# EAGLE design main_board (EAGLE 7.5.0)
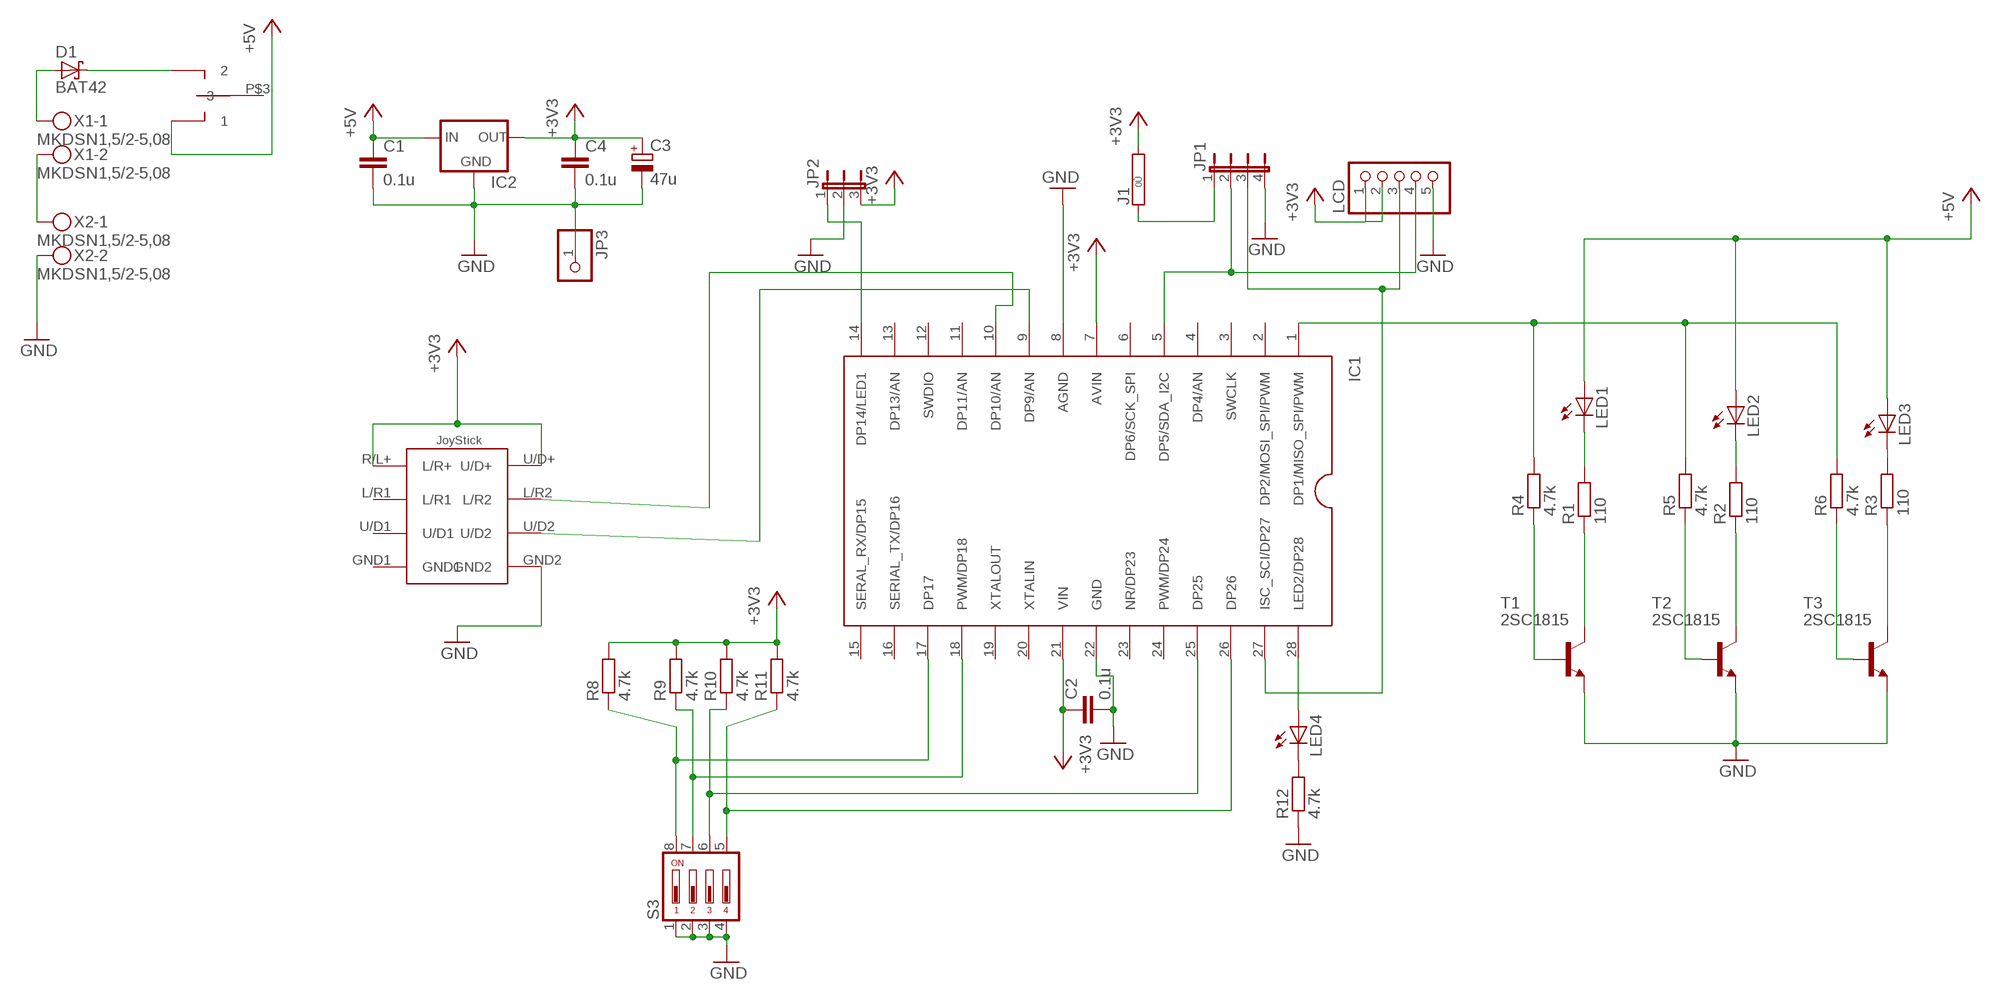
[diagram p0: schematic, sheet 1]

## Parts
C1  0.1u  C-EU025-024X044  [C025-024X044]
C2  0.1u  C-EU025-024X044  [C025-024X044]
C3  47u  CPOL-EUE2.5-5  [E2,5-5]
C4  0.1u  C-EU025-024X044  [C025-024X044]
D1  BAT42  [DO35-10]
IC1  LPC1114FN28  [DIP28]
IC2  78XXL  [78XXL]
J1  0R  [0R/10]
JP1  JP4E  [JP4]
JP2  JP2E  [JP2]
JP3  PINHD-1X1  [1X01]
LCD  PINHD-1X5  [1X05]
LED1  LED5MM  [LED5MM]
LED2  LED5MM  [LED5MM]
LED3  LED5MM  [LED5MM]
LED4  LED3MM  [LED3MM]
R1  110  R-EU_0207/10  [0207/10]
R2  110  R-EU_0207/10  [0207/10]
R3  110  R-EU_0207/10  [0207/10]
R4  4.7k  R-EU_0204/7  [0204/7]
R5  4.7k  R-EU_0204/7  [0204/7]
R6  4.7k  R-EU_0204/7  [0204/7]
R8  4.7k  R-EU_0204/7  [0204/7]
R9  4.7k  R-EU_0204/7  [0204/7]
R10  4.7k  R-EU_0204/7  [0204/7]
R11  4.7k  R-EU_0204/7  [0204/7]
R12  4.7k  R-EU_0204/7  [0204/7]
S3  DIP04YL  [DIP04YL]
T1  2SC1815  [TO92-ECB]
T2  2SC1815  [TO92-ECB]
T3  2SC1815  [TO92-ECB]
U$1  ANALOGJOYSTICK  [ANLOGJOYSTICK]
U$2  TOGGLE-B-12JV  [TOGGLE-B-12JV]
X1  MKDSN1,5/2-5,08  [MKDSN1,5/2-5,08]
X2  MKDSN1,5/2-5,08  [MKDSN1,5/2-5,08]

## Nets
+3V3: C2.1 C3.+ C4.1 IC1.7(AVIN) IC1.21(VIN) IC2.OUT J1.2 JP2.3 LCD.1 LCD.2 R8.2 R9.2 R10.2 R11.2 U$1.R/L+(L/R+) U$1.U/D+
+5V: C1.1 IC2.IN LED1.A LED2.A LED3.A U$2.P$1
GND: C1.2 C2.2 C3.- C4.2 IC1.8(AGND) IC1.22(GND) IC2.GND JP1.4 JP2.2 JP3.1 LCD.5 R12.1 S3.1 S3.2 S3.3 S3.4 T1.E T2.E T3.E U$1.GND2 X2.2
N$1: R4.1 T1.B
N$2: IC1.1(DP1/MISO_SPI/PWM) R4.2 R5.2 R6.2
N$3: R5.1 T2.B
N$4: R6.1 T3.B
N$5: IC1.27(ISC_SCI/DP27) JP1.3 LCD.3
N$6: LED2.K(C) R2.2
N$7: LED1.K(C) R1.2
N$8: LED3.K(C) R3.2
N$9: R1.1 T1.C
N$10: R2.1 T2.C
N$11: R3.1 T3.C
N$12: IC1.5(DP5/SDA_I2C) JP1.2 LCD.4
N$13: IC1.14(DP14/LED1) JP2.1
N$14: LED4.K(C) R12.2
N$15: IC1.28(LED2/DP28) LED4.A
N$16: IC1.17(DP17) R8.1 S3.8
N$17: IC1.18(PWM/DP18) R9.1 S3.7
N$18: IC1.25(DP25) R10.1 S3.6
N$19: IC1.26(DP26) R11.1 S3.5
N$20: IC1.10(DP10/AN) U$1.L/R2
N$21: IC1.9(DP9/AN) U$1.U/D2
N$22: X1.2 X2.1
N$23: D1.A X1.1
N$24: D1.C U$2.P$2
N$25: J1.1 JP1.1
Unconnected: IC1.2(DP2/MOSI_SPI/PWM) IC1.3(SWCLK) IC1.4(DP4/AN) IC1.6(DP6/SCK_SPI) IC1.11(DP11/AN) IC1.12(SWDIO) IC1.13(DP13/AN) IC1.15(SERAL_RX/DP15) IC1.16(SERIAL_TX/DP16) IC1.19(XTALOUT) IC1.20(XTALIN) IC1.23(NR/DP23) IC1.24(PWM/DP24) U$1.GND1 U$1.L/R1 U$1.U/D1 U$2.P$3

## Library data of the parts
C1 C2 C4 = rcl:C-EU: CAPACITOR, European symbol
C3 = rcl:CPOL-EU: POLARIZED CAPACITOR, European symbol
D1 = diode:BAT42: DIODE barrier diode
IC1 = lpc1114fn28:LPC1114FN28
IC2 = v-reg:78XXL: VOLTAGE REGULATOR
J1 = jumper:0R: Bridge 0R 10mm
JP1 = jumper:JP4E: JUMPER
JP2 = jumper:JP2E: JUMPER
JP3 = pinhead:PINHD-1X1: PIN HEADER
LCD = pinhead:PINHD-1X5: PIN HEADER
LED1-LED4 = led:LED: LED OSRAM: - CHIPLED LG R971, LG N971, LY N971, LG Q971, LY Q971, LO R971, LY R971 LH N974, LH R974 LS Q976, LO Q976, LY Q976 LO Q996 - Hyper CHIPLED LW Q18S LB Q993, LB Q99A, LB R99A - SideLED LS A670, LO A670, LY A670, LG A670, LP A670 LB A673, LV A673, LT A673, LW A673 LH A674 LY A675 LS A676, LA A676, LO A676, LY A676, LW A676 LS A679, LY A679, LG A679 - Hyper Micro SIDELED® LS Y876, LA Y876, LO Y876, LY Y876 LT Y87S - SmartLED LW L88C, LW L88S LB L89C, LB L89S, LG L890 LS L89K, LO L89K, LY L89K LS L896, LA L896, LO L896, LY L896 - TOPLED LS T670, LO T670, LY T670, LG T670, LP T670 LSG T670, LSP T670, LSY T670, LOP T670, LYG T670 LG T671, LOG T671, LSG T671 LB T673, LV T673, LT T673, LW T673 LH T674 LS T676, LA T676, LO T676, LY T676, LB T676, LH T676, LSB T676, LW T676 LB T67C, LV T67C, LT T67C, LS T67K, LO T67K, LY T67K, LW E67C LS E67B, LA E67B, LO E67B, LY E67B, LB E67C, LV E67C, LT E67C LW T67C LS T679, LY T679, LG T679 LS T770, LO T770, LY T770, LG T770, LP T770 LB T773, LV T773, LT T773, LW T773 LH T774 LS E675, LA E675, LY E675, LS T675 LS T776, LA T776, LO T776, LY T776, LB T776 LHGB T686 LT T68C, LB T68C - Hyper Mini TOPLED® LB M676 - Mini TOPLED Santana® LG M470 LS M47K, LO M47K, LY M47K Source: http://www.osram.convergy.de LUXEON: - LUMILED® LXK2-PW12-R00, LXK2-PW12-S00, LXK2-PW14-U00, LXK2-PW14-V00 LXK2-PM12-R00, LXK2-PM12-S00, LXK2-PM14-U00 LXK2-PE12-Q00, LXK2-PE12-R00, LXK2-PE12-S00, LXK2-PE14-T00, LXK2-PE14-U00 LXK2-PB12-K00, LXK2-PB12-L00, LXK2-PB12-M00, LXK2-PB14-N00, LXK2-PB14-P00, LXK2-PB14-Q00 LXK2-PR12-L00, LXK2-PR12-M00, LXK2-PR14-Q00, LXK2-PR14-R00 LXK2-PD12-Q00, LXK2-PD12-R00, LXK2-PD12-S00 LXK2-PH12-R00, LXK2-PH12-S00 LXK2-PL12-P00, LXK2-PL12-Q00, LXK2-PL12-R00 Source: www.luxeon.com KINGBRIGHT: KA-3528ASYC Source: www.kingbright.com
R1-R6 R8-R12 = rcl:R-EU_: RESISTOR, European symbol
S3 = switch-dil:DIP04YL: DIL/CODE SWITCH; OC_FARNELL: unknown; OC_NEWARK: unknown
T1-T3 = transistor:2SC1815: NPN EPITAXIAL TRANSISTOR Source: TOSHIBA .. 2SC1815 1.pdf
U$1 = AnalogJoyStick:ANALOGJOYSTICK
U$2 = toggle_b-12JV:TOGGLE-B-12JV
X1 X2 = con-phoenix-508:MKDSN1,5/2-5,08: MKDSN 1,5/ 2-5,08 Printklemme Nennstrom: 13,5 A Nennspannung: 250 V Rastermaß: 5,08 mm Polzahl: 2 Anschlussart: Schraubanschluss Montage: Löten Anschlussrichtung Leiter/Platine: 0 ° Artikelnummer: 1729128 Source: http://eshop.phoenixcontact.com .. 1729128.pdf

## Board
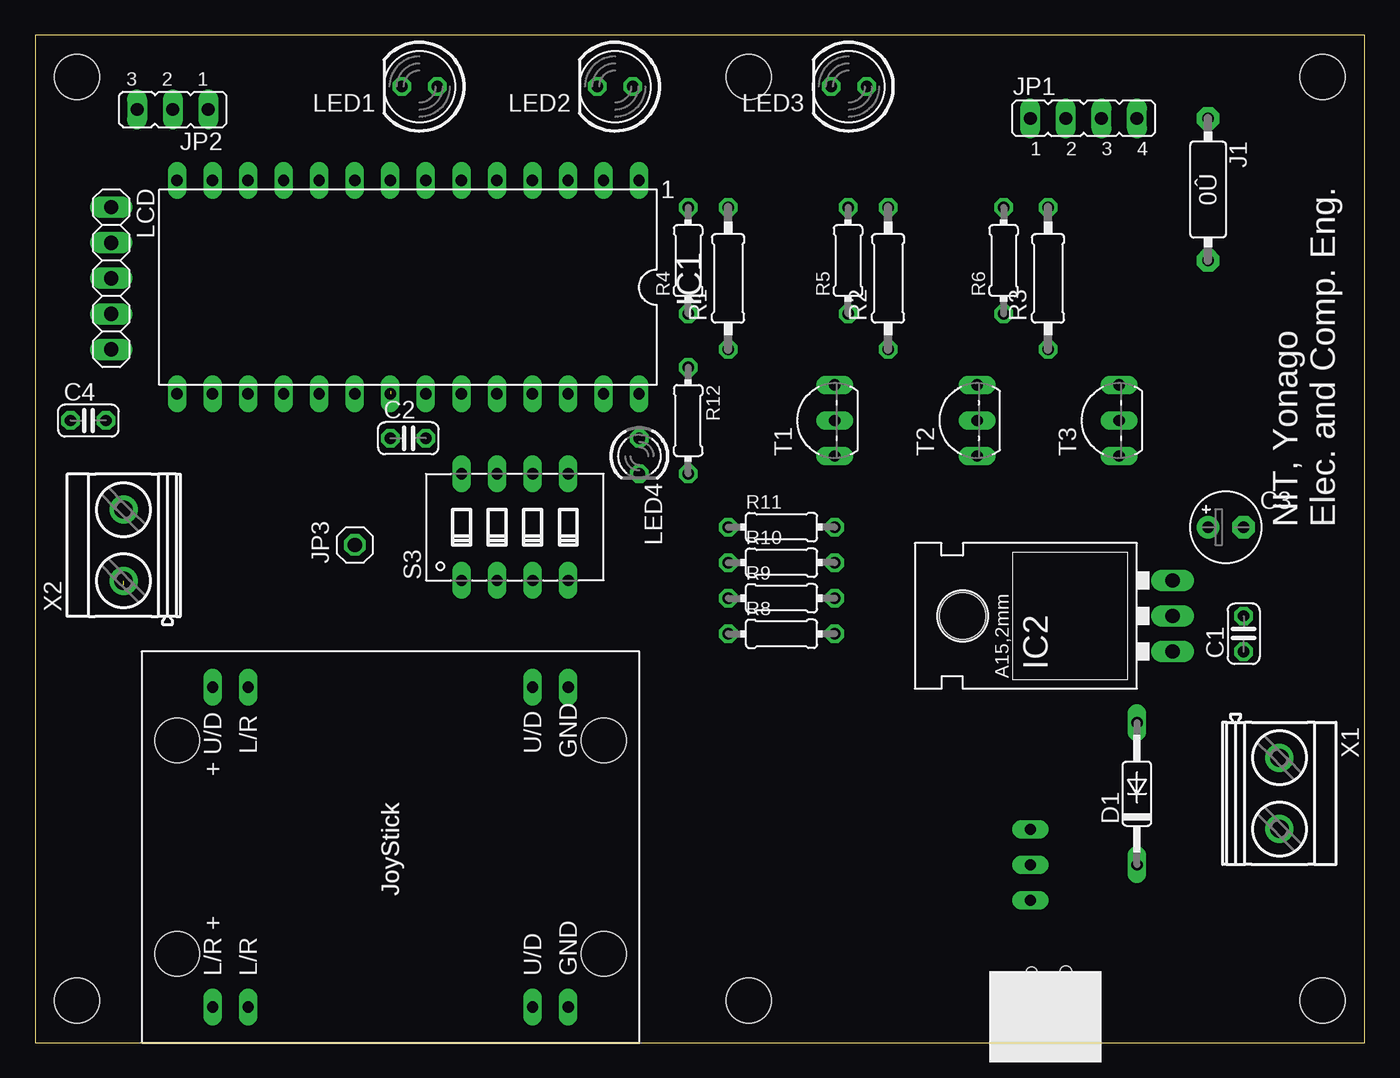
[diagram p1: board, top side]
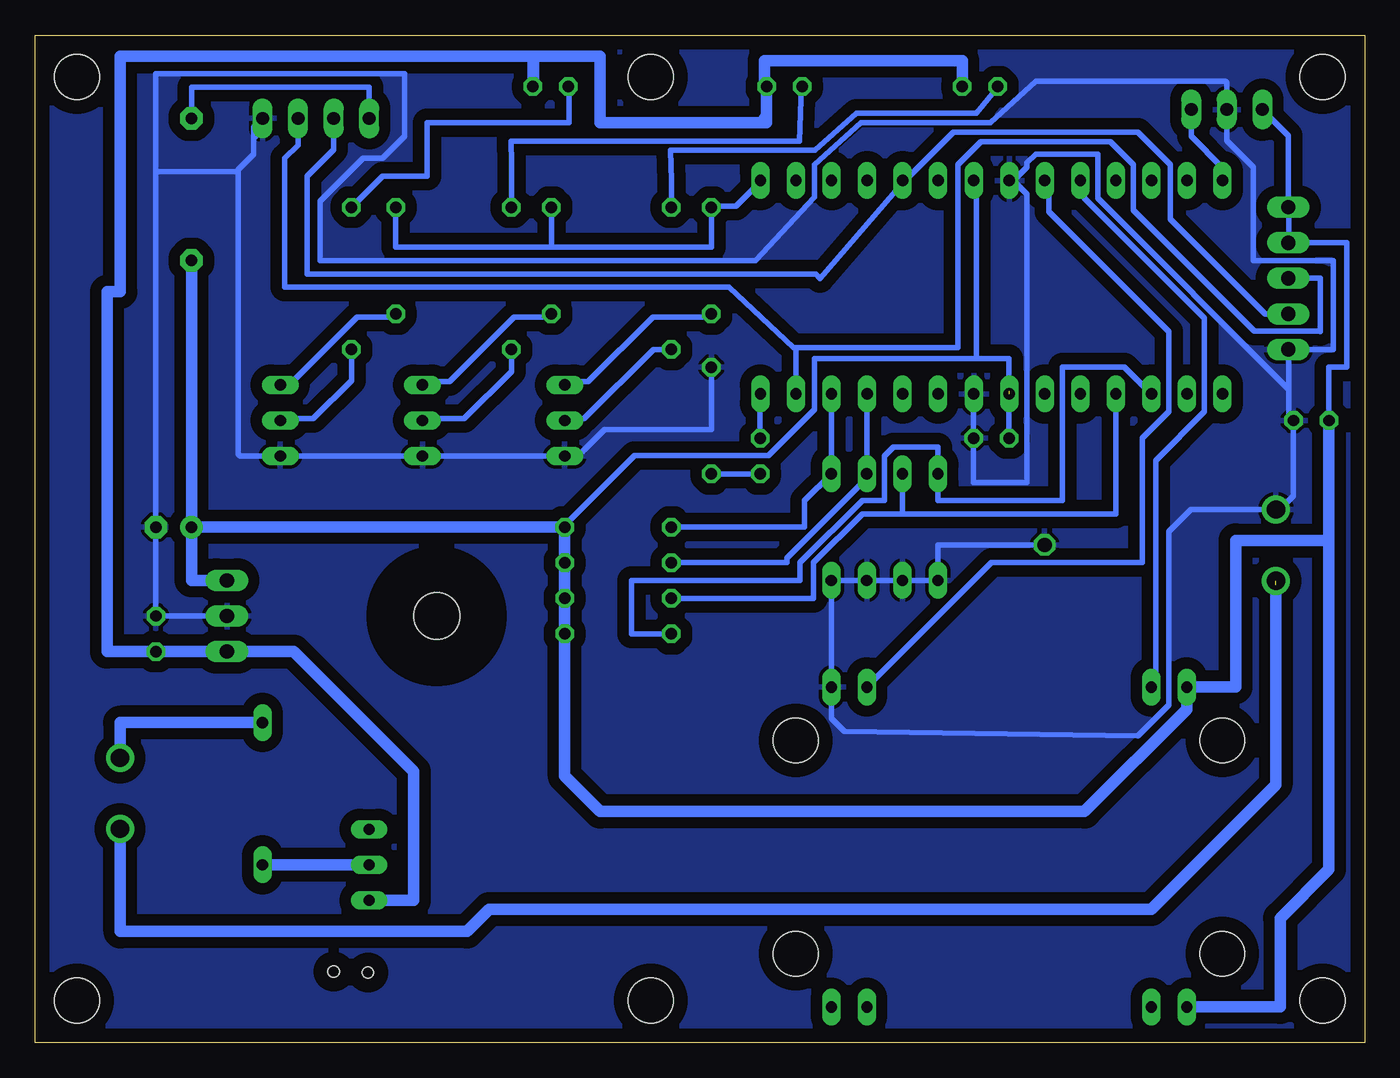
[diagram p2: board, bottom side, seen from below]

Size 95 x 72 mm. Coordinates in mm from the lower left corner, seen from the top.
Outline: 0,0 95,0 95,72 0,72 0,0
Copper layers (1*16): Top 0.035mm / dielectric 1.5mm / Bottom 0.035mm
Design rules "default *": minimum track width 16mil, minimum drill 24mil, track to track 10mil, track to pad 10mil, pad to pad 10mil, via to via 10mil, smd to smd 8mil, copper to edge 40mil, drill to drill 8mil, minimum pad ring 10mil, minimum via ring 8mil, stop-mask expansion 4mil, vias tented up to drill 0mil, thermal gap 10mil
Holes 3.2 mm at 3,3 3,69 92,69 92,3 51,3 51,69

### Footprints (pad centres in the part's own frame; a part is rotated, then mirrored left to right if it is on the bottom)
C025-024X044 = drill 0.813 octagon: 1 -1.27,0; 2 1.27,0
E2,5-5 = drill 0.813 pad 1.6: + -1.27,0 | drill 0.813 pad 1.6 octagon: - 1.27,0
DO35-10 = drill 0.813 long: A 5.08,0; C -5.08,0
DIP28 = drill 0.813 long: 1 -16.51,-7.62; 2 -13.97,-7.62; 3 -11.43,-7.62; 4 -8.89,-7.62; 5 -6.35,-7.62; 6 -3.81,-7.62; 7 -1.27,-7.62; 8 1.27,-7.62; 9 3.81,-7.62; 10 6.35,-7.62; 11 8.89,-7.62; 12 11.43,-7.62; 13 13.97,-7.62; 14 16.51,-7.62; 15 16.51,7.62; 16 13.97,7.62; 17 11.43,7.62; 18 8.89,7.62; 19 6.35,7.62; 20 3.81,7.62; 21 1.27,7.62; 22 -1.27,7.62; 23 -3.81,7.62; 24 -6.35,7.62; 25 -8.89,7.62; 26 -11.43,7.62; 27 -13.97,7.62; 28 -16.51,7.62
78XXL = drill 1.016 long: GND 0,-3.81; IN -2.54,-3.81; OUT 2.54,-3.81 | hole 3.302: 0,11.176
0R/10 = drill 0.813 pad 1.6 octagon: 1 -5.08,0; 2 5.08,0
JP4 = drill 0.914 long: 1 -3.81,0; 2 -1.27,0; 3 1.27,0; 4 3.81,0
JP2 = drill 0.914 long: 1 -2.54,0; 2 0,0; 3 2.54,0
1X01 = drill 1.016 octagon: 1 0,0
1X05 = drill 1.016 long: 1 -5.08,0; 2 -2.54,0; 3 0,0; 4 2.54,0; 5 5.08,0
LED5MM = drill 0.813 octagon: A -1.27,0; K 1.27,0
LED3MM = drill 0.813 octagon: A -1.27,0; K 1.27,0
0207/10 = drill 0.813 octagon: 1 -5.08,0; 2 5.08,0
0204/7 = drill 0.813 octagon: 1 -3.81,0; 2 3.81,0
DIP04YL = drill 0.813 long: 1 -3.81,-3.81; 2 -1.27,-3.81; 3 1.27,-3.81; 4 3.81,-3.81; 5 3.81,3.81; 6 1.27,3.81; 7 -1.27,3.81; 8 -3.81,3.81
TO92-ECB = drill 0.813 long: B 2.54,0; C 0,0; E -2.54,0
ANLOGJOYSTICK = drill 0.8 long: GND1 2.54,5.08; GND2 25.4,5.08; L/R1 2.54,27.94; L/R2 25.4,27.94; R/L+ 2.54,30.48; U/D1 2.54,7.62; U/D2 25.4,7.62; U/D+ 25.4,30.48 | hole 3.2: 6.35,2.54; 21.59,2.54; 6.35,33.02; 21.59,33.02
TOGGLE-B-12JV = drill 0.8 long: P$1 5.08,5.08; P$2 7.62,5.08; P$3 10.16,5.08 | hole 0.8: 0,2.54; -0.08,5
MKDSN1,5/2-5,08 = drill 1.3 pad 2: 1 -2.561,0.025; 2 2.519,0.025

### Placement (x,y rotation side)
C1  86.36,29.21 90 top
C2  26.67,43.18 0 top
C3  85.09,36.83 0 top
C4  3.81,44.45 0 top
D1  78.74,17.78 90 top
IC1  26.66,53.98 180 top
IC2  77.47,30.48 90 top
J1  83.82,60.96 270 top
JP1  74.93,66.04 0 top
JP2  9.84,66.67 180 top
JP3  22.86,35.56 90 top
LCD  5.45,54.61 270 top
LED1  27.48,68.31 180 top
LED2  41.45,68.31 180 top
LED3  58.15,68.31 180 top
LED4  43.18,41.91 270 top
R1  49.53,54.61 90 top
R2  60.96,54.61 90 top
R3  72.39,54.61 90 top
R4  46.67,55.88 90 top
R5  58.1,55.88 90 top
R6  69.22,55.88 90 top
R8  53.34,29.21 0 top
R9  53.34,31.75 0 top
R10  53.34,34.29 0 top
R11  53.34,36.83 0 top
R12  46.67,44.45 270 top
S3  34.29,36.83 0 top
T1  57.15,44.45 90 top
T2  67.31,44.45 90 top
T3  77.47,44.45 90 top
U$1  43.18,0 90 top
U$2  76.2,5.08 90 top
X1  88.9,17.78 270 top
X2  6.35,35.56 90 top

### Tracks (layer width: path | path; a pad name or v marks a point on that pad's centre or on a via)
+3V3  (1 unrouted)
  Bottom 0.406: 5.4,59.69 LCD.1 | 57.15,34.92 R10.2 | C2.1 25.43,43.26 25.43,46.35 IC1.21 | 27.74,48.87 27.74,61.42 IC1.7 | 27.74,48.87 39.29,48.87 39.29,45.24 42.6,41.94 52.17,41.94 57.12,36.98 R11.2 | C4.1 2.54,48.26 1.27,48.26 1.27,57.15 5.4,57.15 | 5.4,57.15 LCD.2 | 5.4,57.15 5.4,59.64 LCD.1 | LCD.1 5.45,64.82 JP2.3 | 25.43,46.56 25.43,48.87 27.74,48.87
  Bottom 0.813: IC2.OUT 83.82,33.02 C3.+ | C3.+ J1.2 | C3.+ R11.2 R10.2 R9.2 R8.2 57.15,19.05 54.61,16.51 20,16.51 12.7,23.81 U$1.U/D+ 9.21,25.4 9.21,35.88 2.54,35.88 | 2.54,35.88 2.54,12.38 6.03,8.89 6.03,2.54 U$1.R/L+ | C4.1 2.54,35.88
+5V
  Bottom 0.813: U$2.P$1 67.94,10.16 67.94,19.37 76.52,27.94 IC2.IN C1.1 89.85,27.94 89.85,53.66 88.9,53.66 88.9,70.48 59.42,70.48 LED3.A 59.37,68.31 59.37,70.48 54.61,70.48 54.61,65.72 42.72,65.72 42.72,66.18 | 42.86,66.04 42.72,66.18 | 42.72,66.18 LED2.A 42.86,68.31 42.86,70.17 28.75,70.17 LED1.A
GND
  Bottom 0.406: JP3.1 30.48,35.56 S3.1 S3.2 S3.3 S3.4 U$1.GND2 38.1,23.16 37.16,22.22 16.19,21.91 13.97,24.13 13.97,36.51 12.4,38.08 X2.2 6.05,38.08 5.08,39.05 C4.2 5.4,44.77 5.4,46.67 | IC1.22 C2.2 27.94,40.01 24.13,40.01 24.13,60.64 25.08,61.59 | 5.4,46.67 5.4,49.53 LCD.5 2.22,49.53 2.22,55.88 7.94,55.88 7.94,62.55 9.84,64.45 JP2.2 | 25.08,61.59 24.13,62.55 24.13,62.87 23.5,63.5 19.05,63.5 19.05,60.33 5.4,46.67 | 25.08,61.59 IC1.8 | IC2.GND C1.2 C3.- 86.36,62.23 | JP1.4 79.38,65.41 79.38,64.72 | 79.38,64.72 79.38,63.5 80.49,62.39 | 9.91,66.7 JP2.2 | 79.25,64.72 79.38,64.72 | 86.36,62.23 86.36,69.22 68.58,69.22 68.58,64.77 70.17,63.18 71.54,63.18 74.61,60.11 74.61,55.88 43.52,55.88 39.29,60.43 39.29,62.74 35.98,65.73 26.73,65.73 23.47,68.68 9.94,68.68 9.84,68.58 JP2.2 | 80.49,62.39 80.64,62.23 86.36,62.23 | 80.49,62.39 80.49,42.07 80.33,41.91 T3.E T2.E T1.E 56.2,41.91 54.29,43.81 46.67,43.81 R12.1
  pour Bottom (isolate 0.813): 0,72.07 94.93,72.07 94.93,0 0,0
N$1
  Bottom 0.406: T1.B 57.12,47.22 55.47,47.22 50.85,51.84 46.89,51.84 R4.1
N$2
  Bottom 0.406: 46.56,59.77 R4.2 | IC1.1 43.26,61.42 44.91,59.77 46.6,59.77 R4.2 | R4.2 46.67,56.83 58.1,56.83 | R5.2 58.1,56.83 | 58.1,56.83 69.22,56.83 R6.2
N$3
  Bottom 0.406: T2.B 67.03,47.22 65.38,47.22 60.76,51.84 58.12,51.84 R5.1
N$4
  Bottom 0.406: T3.B 77.27,47.22 76.61,47.22 71.98,51.84 69.34,51.84 R6.1
N$5
  Bottom 0.406: 5.28,54.48 LCD.3 3.17,54.61 3.17,50.8 3.23,50.85 7.89,50.85 16.51,59.47 16.51,62.74 18.16,64.39 27.41,64.39 29.06,62.74 29.06,49.68 40.8,49.68 | IC1.27 40.64,46.37 40.64,49.53 40.8,49.68 | 40.8,49.68 45.4,53.98 77.15,53.98 77.15,63.18 76.2,64.14 JP1.3
N$6
  Bottom 0.406: LED2.K 40.28,68.02 40.28,67.36 40.36,64.43 60.98,64.43 60.96,62.87 R2.2
N$7
  Bottom 0.406: LED1.K 26.42,68.02 27.72,66.4 36.31,66.4 39.26,63.77 49.58,63.77 49.53,61.59 R1.2
N$8
  Bottom 0.406: LED3.K 56.83,68.31 56.83,65.72 66.99,65.72 66.99,61.91 70.17,61.91 R3.2
N$9
  Bottom 0.406: R1.1 50.8,49.53 55.75,44.58 57.12,44.58 T1.C
N$10
  Bottom 0.406: 67.03,44.58 66.67,44.58 | 66.67,44.58 64.33,44.58 60.96,47.94 R2.1 | T2.C 66.67,44.45 66.67,44.58
N$11
  Bottom 0.406: 77.6,44.58 77.47,44.58 | 77.47,44.58 75.12,44.58 72.39,47.31 R3.1 | T3.C 77.47,44.58
N$12
  Bottom 0.406: 73.97,66.04 JP1.2 73.66,63.82 75.56,61.91 75.56,54.93 39.19,54.93 38.9,54.59 33.02,61.42 IC1.5 32.69,61.75 29.39,65.05 16.18,65.05 13.87,62.74 13.87,58.84 7.1,52.07 LCD.4
N$13
  Bottom 0.406: IC1.14 10.14,62.53 12.38,64.77 JP2.1
N$14
  Bottom 0.406: LED4.K R12.2
N$15
  Bottom 0.406: LED4.A IC1.28
N$16
  Bottom 0.406: IC1.17 17.14,48.26 21.59,48.26 21.59,38.73 30.48,38.73 S3.8 30.48,42.55 33.66,42.55 34.29,41.91 34.29,38.73 35.88,38.73 40.32,34.29 40.32,33.02 52.39,33.02 52.39,29.21 R8.1
N$17
  Bottom 0.406: R9.1 39.37,31.75 39.37,34.29 35.88,37.78 33.02,37.78 | S3.7 33.02,37.78 | IC1.18 17.77,37.78 33.02,37.78
N$18
  Bottom 0.406: IC1.25 S3.6 35.56,40.32 41.27,34.61 41.27,34.29 R10.1
N$19
  Bottom 0.406: IC1.26 S3.5 40.01,38.73 40.01,36.83 R11.1
N$20
  Bottom 0.406: U$1.L/R2 14.92,25.72 14.92,41.59 11.43,45.09 11.43,51.75 20,60.33 20,61.59 IC1.10
N$21
  Bottom 0.406: U$1.U/D2 26.67,34.29 15.88,34.29 15.88,43.18 13.97,45.09 13.97,50.8 22.54,59.37 22.54,61.59 IC1.9
N$22  (1 unrouted)
  Bottom 0.406: 88.9,15.24 X1.2
  Bottom 0.813: 6.35,32.7 6.35,18.41 15.24,9.53 62.55,9.53 64.14,7.94 88.9,7.94 88.9,15.24 X1.2
N$23
  Bottom 0.813: D1.A 88.92,22.86 X1.1
N$24
  Bottom 0.813: U$2.P$2 D1.C
N$25
  Bottom 0.406: JP1.1 71.12,68.26 83.82,68.26 J1.1

### Text on the board
tPlace: NIT, Yonago / Elec. and Comp. Eng.